# Altium schematic sheet Thermistors.SchDoc
size A
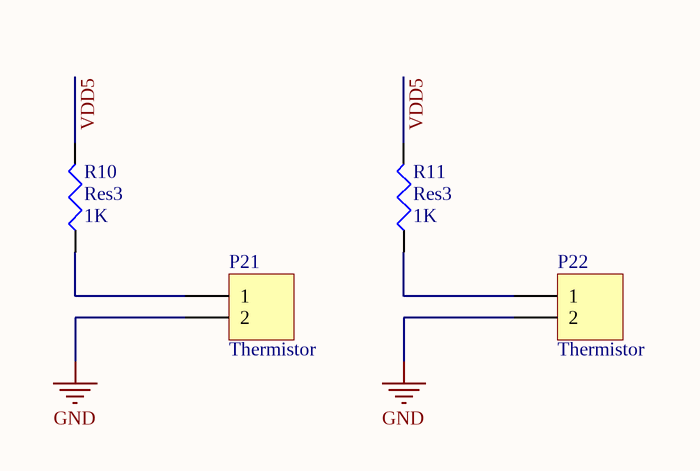
[diagram p0: Thermistors.SchDoc]

## Parts
P21  Thermistor  [HDR1X2]
P22  Thermistor  [HDR1X2]
R10  Res3  value 1K  [6-0805_L]
R11  Res3  value 1K  [6-0805_L]

## Nets
GND: P21.2 P22.2
VDD5: R10.2 R11.2
NetP21_1: P21.1 R10.1
NetP22_1: P22.1 R11.1

## Library data of the parts
P21 P22 = Header 2: Header, 2-Pin; LatestRevisionDate: 17-Jul-2002; LatestRevisionNote: Re-released for DXP Platform.; Publisher: Altium Limited
R10 R11 = Res3: Resistor; Published: 8-Jun-2000; LatestRevisionDate: 29-May-2009; LatestRevisionNote: IPC-7351 Footprint Added.; PackageReference: J1-0603; Publisher: Altium Limited; PackageDescription: Chip Resistor